# EAGLE design CAN_Funktionsdecoder (EAGLE 9.6.2)
Selectrix Arduino
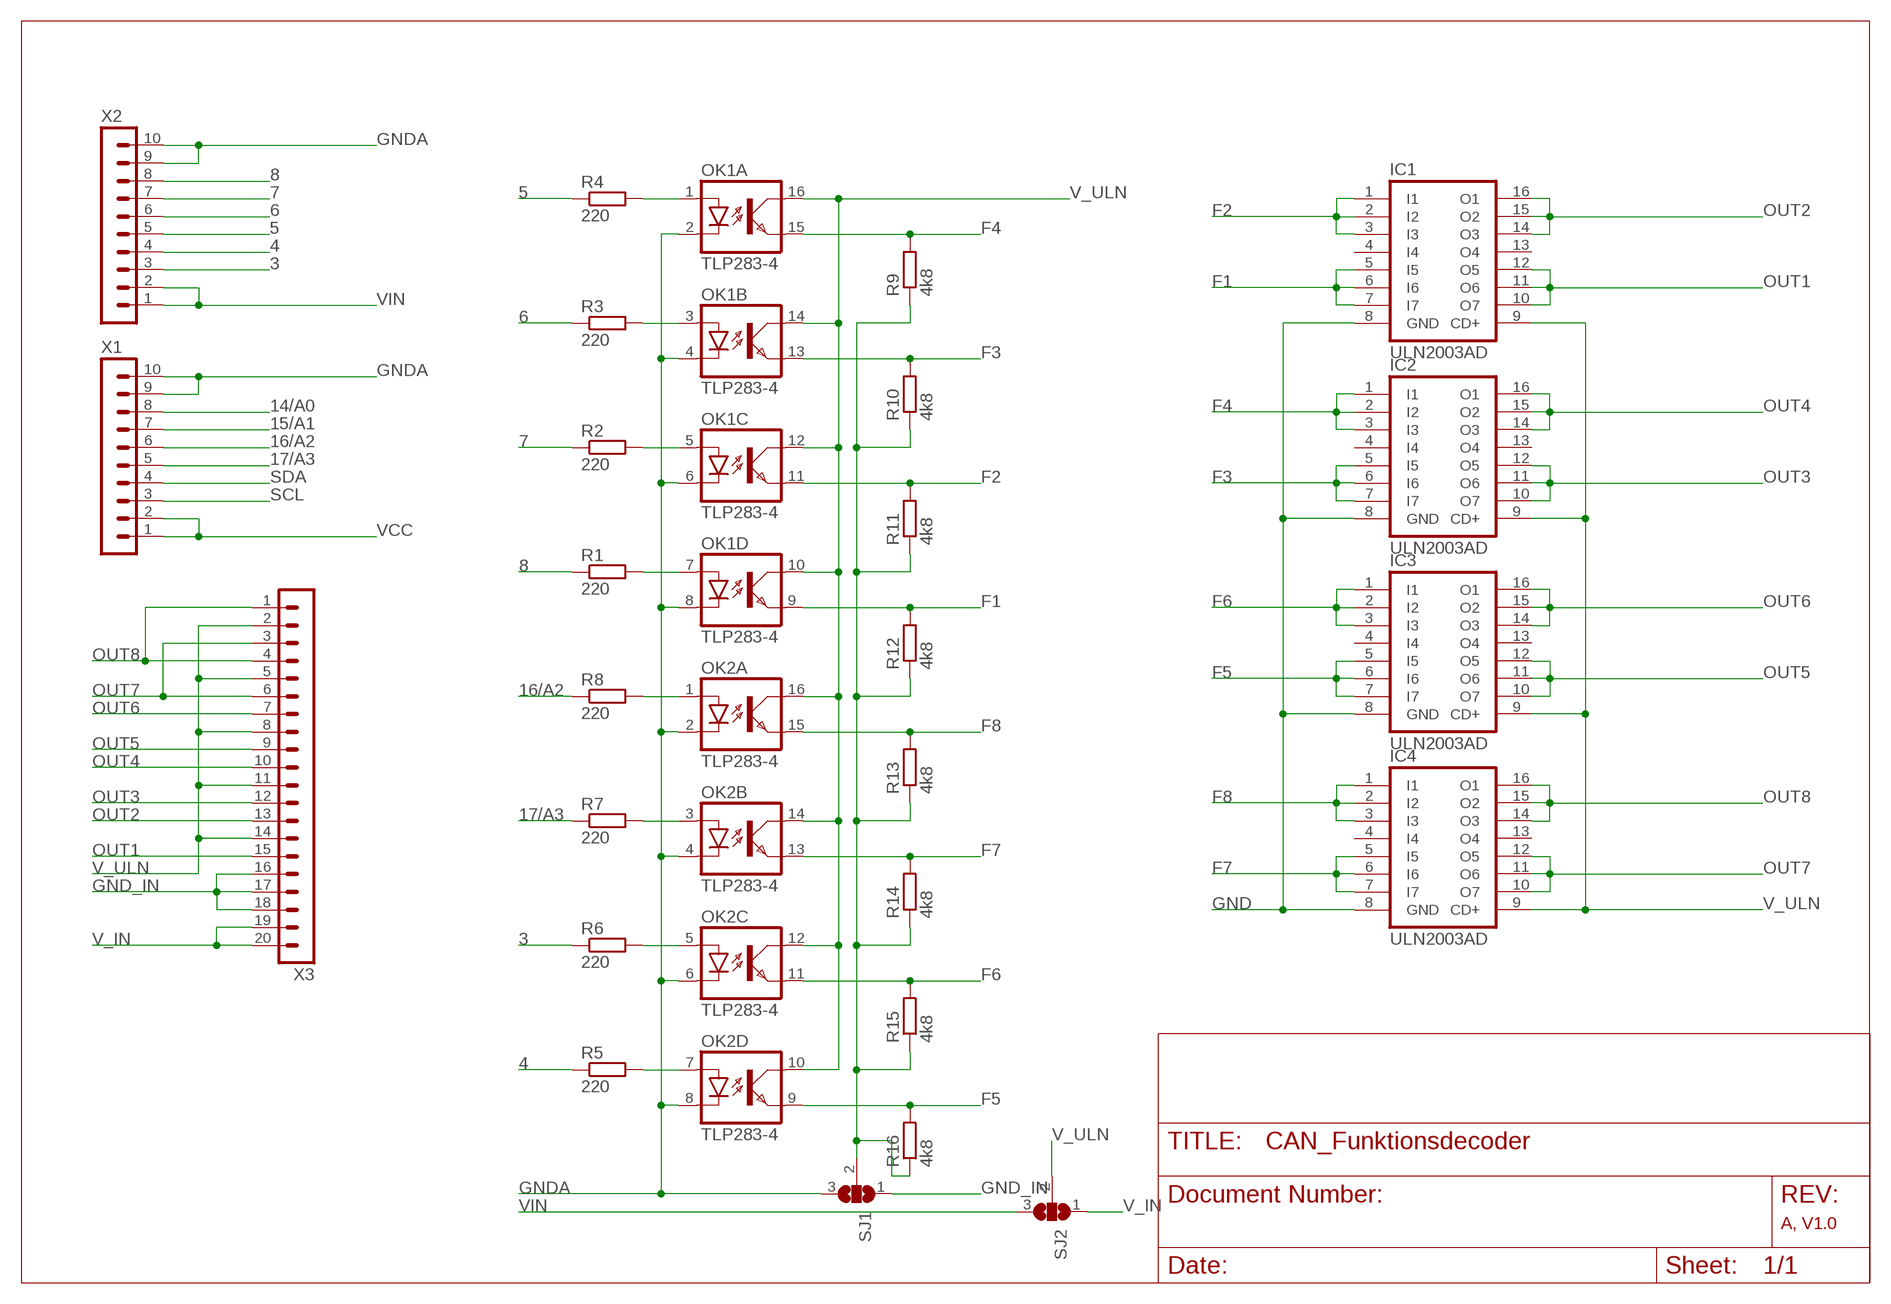
[diagram p0: schematic, sheet 1]

## Parts
IC1  ULN2003AD  [SO16]
IC2  ULN2003AD  [SO16]
IC3  ULN2003AD  [SO16]
IC4  ULN2003AD  [SO16]
OK1  TLP283-4  [MINI-FLAT-16]
OK2  TLP283-4  [MINI-FLAT-16]
R1  220  R-EU_R0805  [R0805]
R2  220  R-EU_R0805  [R0805]
R3  220  R-EU_R0805  [R0805]
R4  220  R-EU_R0805  [R0805]
R5  220  R-EU_R0805  [R0805]
R6  220  R-EU_R0805  [R0805]
R7  220  R-EU_R0805  [R0805]
R8  220  R-EU_R0805  [R0805]
R9  4k8  R-EU_R0805  [R0805]
R10  4k8  R-EU_R0805  [R0805]
R11  4k8  R-EU_R0805  [R0805]
R12  4k8  R-EU_R0805  [R0805]
R13  4k8  R-EU_R0805  [R0805]
R14  4k8  R-EU_R0805  [R0805]
R15  4k8  R-EU_R0805  [R0805]
R16  4k8  R-EU_R0805  [R0805]
SJ1  SJ2W  [SJ_2]
SJ2  SJ2W  [SJ_2]
X1  MA10-1  [MA10-1]
X2  MA10-1  [MA10-1]
X3  MA20-1  [MA20-1]

## Nets
3: R6.1 X2.3
4: R5.1 X2.4
5: R4.1 X2.5
6: R3.1 X2.6
7: R2.1 X2.7
8: R1.1 X2.8
14/A0: X1.8
15/A1: X1.7
16/A2: R8.1 X1.6
17/A3: R7.1 X1.5
F1: IC1.5(I5) IC1.6(I6) IC1.7(I7) OK1.9(D:EMIT) R12.2
F2: IC1.1(I1) IC1.2(I2) IC1.3(I3) OK1.11(C:EMIT) R11.2
F3: IC2.5(I5) IC2.6(I6) IC2.7(I7) OK1.13(B:EMIT) R10.2
F4: IC2.1(I1) IC2.2(I2) IC2.3(I3) OK1.15(A:EMIT) R9.2
F5: IC3.5(I5) IC3.6(I6) IC3.7(I7) OK2.9(D:EMIT) R16.2
F6: IC3.1(I1) IC3.2(I2) IC3.3(I3) OK2.11(C:EMIT) R15.2
F7: IC4.5(I5) IC4.6(I6) IC4.7(I7) OK2.13(B:EMIT) R14.2
F8: IC4.1(I1) IC4.2(I2) IC4.3(I3) OK2.15(A:EMIT) R13.2
GND: IC1.8(GND) IC2.8(GND) IC3.8(GND) IC4.8(GND) R9.1 R10.1 R11.1 R12.1 R13.1 R14.1 R15.1 R16.1 SJ1.2
GND_IN: SJ1.1 X3.16 X3.17 X3.18
GNDA: OK1.2(A:C) OK1.4(B:C) OK1.6(C:C) OK1.8(D:C) OK2.2(A:C) OK2.4(B:C) OK2.6(C:C) OK2.8(D:C) SJ1.3 X1.9 X1.10 X2.9 X2.10
N$2: OK1.3(B:A) R3.2
N$3: OK1.1(A:A) R4.2
N$4: OK1.5(C:A) R2.2
N$5: OK1.7(D:A) R1.2
N$6: OK2.1(A:A) R8.2
N$7: OK2.3(B:A) R7.2
N$8: OK2.5(C:A) R6.2
N$9: OK2.7(D:A) R5.2
OUT1: IC1.10(O7) IC1.11(O6) IC1.12(O5) X3.15
OUT2: IC1.14(O3) IC1.15(O2) IC1.16(O1) X3.13
OUT3: IC2.10(O7) IC2.11(O6) IC2.12(O5) X3.12
OUT4: IC2.14(O3) IC2.15(O2) IC2.16(O1) X3.10
OUT5: IC3.10(O7) IC3.11(O6) IC3.12(O5) X3.9
OUT6: IC3.14(O3) IC3.15(O2) IC3.16(O1) X3.7
OUT7: IC4.10(O7) IC4.11(O6) IC4.12(O5) X3.3 X3.6
OUT8: IC4.14(O3) IC4.15(O2) IC4.16(O1) X3.1 X3.4
SCL: X1.3
SDA: X1.4
V_IN: SJ2.1 X3.19 X3.20
V_ULN: IC1.9(CD+) IC2.9(CD+) IC3.9(CD+) IC4.9(CD+) OK1.10(D:COL) OK1.12(C:COL) OK1.14(B:COL) OK1.16(A:COL) OK2.10(D:COL) OK2.12(C:COL) OK2.14(B:COL) OK2.16(A:COL) SJ2.2 X3.2 X3.5 X3.8 X3.11 X3.14
VCC: X1.1 X1.2
VIN: SJ2.3 X2.1 X2.2
Unconnected: IC1.4(I4) IC1.13(O4) IC2.4(I4) IC2.13(O4) IC3.4(I4) IC3.13(O4) IC4.4(I4) IC4.13(O4)

## Notes on the sheet
- A, V1.0

## Library data of the parts
IC1-IC4 = uln-udn:ULN2003A: DRIVER ARRAY
OK1 OK2 = optocoupler:TLP283-4: TOSHIBA PHOTOCOUPLER GaAs IRED & PHOTO-TRANSISTOR Source: http://www.semicon.toshiba.co.jp/td/en/Opto/Photocoupler/en_20050928_TLP283_datasheet.pdf; OC_FARNELL: unknown; OC_NEWARK: unknown
R1-R16 = rcl:R-EU_: RESISTOR, European symbol; SPICEPREFIX: R
SJ1 SJ2 = jumper:SJ2W: SMD solder JUMPER
X1 X2 = con-lstb:MA10-1: PIN HEADER; OC_FARNELL: unknown; OC_NEWARK: unknown
X3 = con-lstb:MA20-1: PIN HEADER; OC_FARNELL: unknown; OC_NEWARK: unknown

## Board
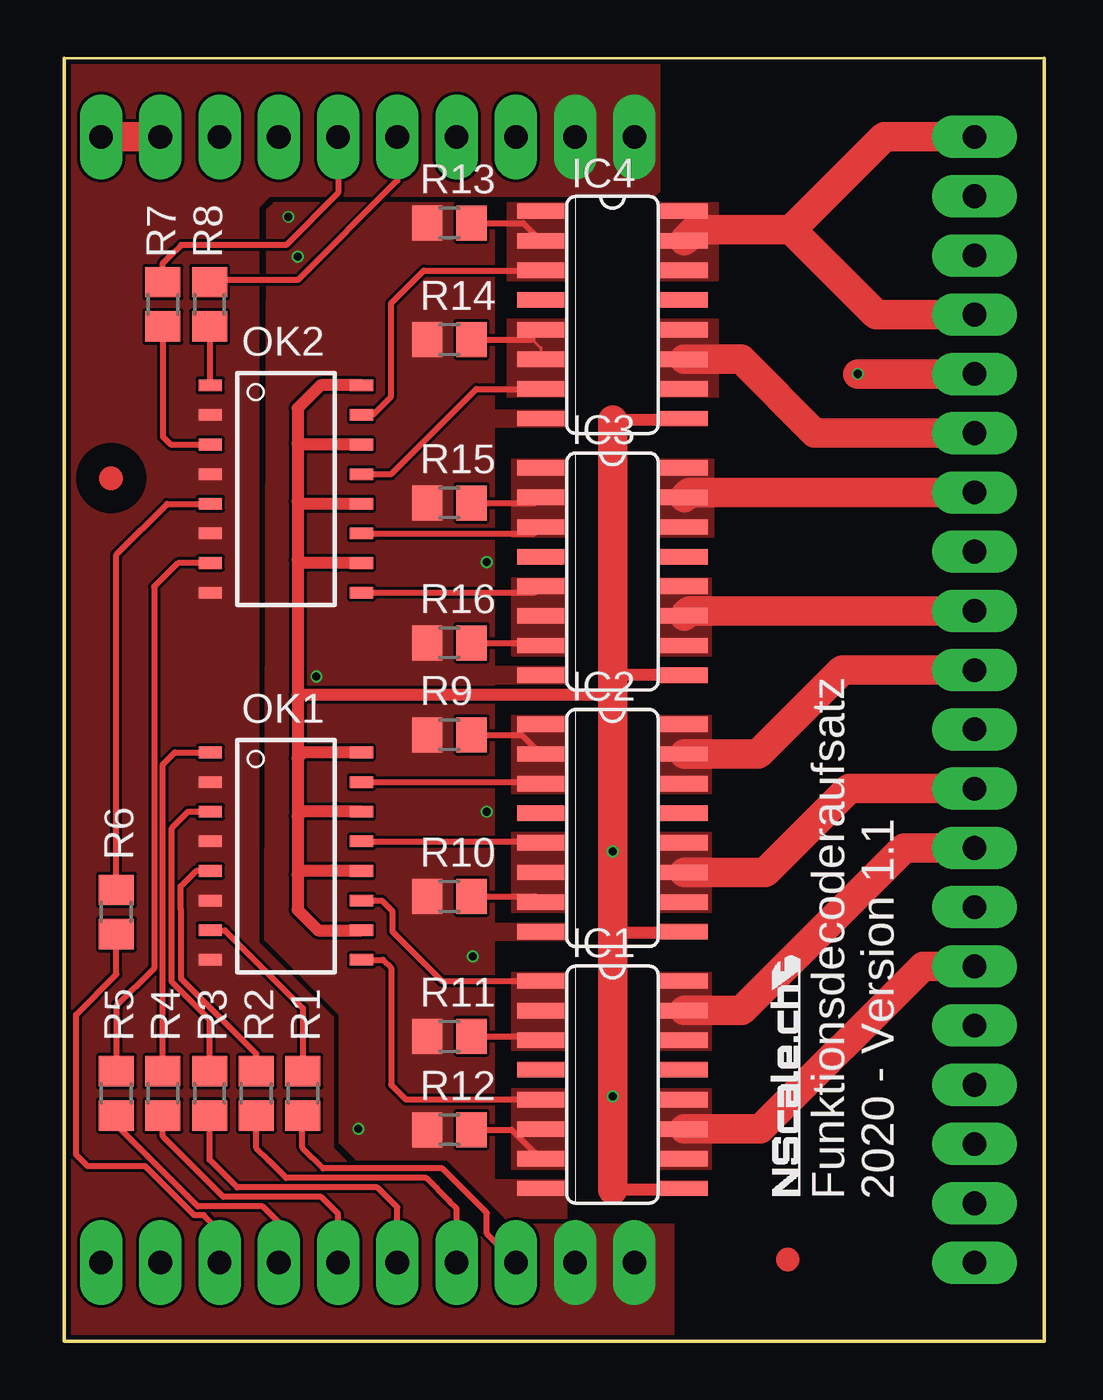
[diagram p1: board, top side]
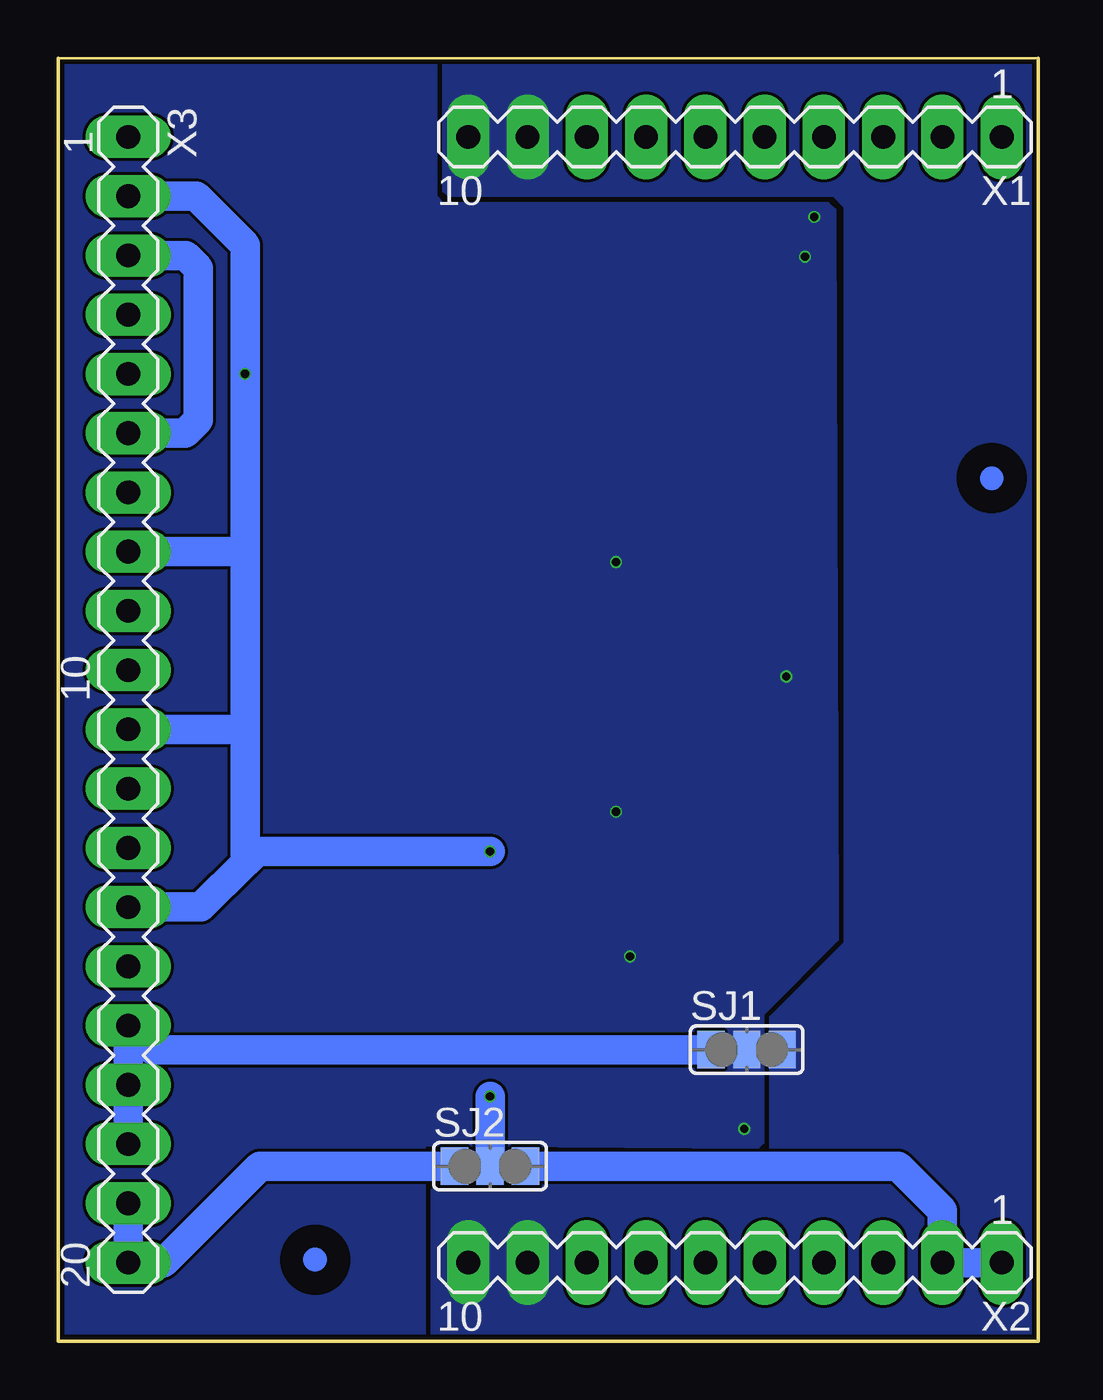
[diagram p2: board, bottom side, seen from below]

Size 42 x 55 mm. Coordinates in mm from the lower left corner, seen from the top.
Outline: 0,0 42,0 42,55 0,55 0,0
Copper layers (1*16): Top 0.035mm / dielectric 1.6mm / Bottom 0.035mm
Design rules "jlcpcb-2layers": minimum track width 5mil, minimum drill 0.3mm, track to track 5mil, track to pad 5mil, pad to pad 5mil, via to via 5mil, smd to smd 5mil, copper to edge 0.2mm, drill to drill 6mil, minimum pad ring 10mil, minimum via ring 3mil, stop-mask expansion 4mil, vias tented up to drill 0mil, thermal gap 10mil

### Footprints (pad centres in the part's own frame; a part is rotated, then mirrored left to right if it is on the bottom)
SO16 = smd 0.66 x 2.032: 1 -4.445,-3.073; 2 -3.175,-3.073; 3 -1.905,-3.073; 4 -0.635,-3.073; 5 0.635,-3.073; 6 1.905,-3.073; 7 3.175,-3.073; 8 4.445,-3.073; 9 4.445,3.073; 10 3.175,3.073; 11 1.905,3.073; 12 0.635,3.073; 13 -0.635,3.073; 14 -1.905,3.073; 15 -3.175,3.073; 16 -4.445,3.073
MINI-FLAT-16 = smd 1 x 0.5: 1 -3.24,4.445; 2 -3.24,3.175; 3 -3.24,1.905; 4 -3.24,0.635; 5 -3.24,-0.635; 6 -3.24,-1.905; 7 -3.24,-3.175; 8 -3.24,-4.445; 9 3.24,-4.445; 10 3.24,-3.175; 11 3.24,-1.905; 12 3.24,-0.635; 13 3.24,0.635; 14 3.24,1.905; 15 3.24,3.175; 16 3.24,4.445
R0805 = smd 1.3 x 1.5: 1 -0.95,0; 2 0.95,0
SJ_2 = smd 1.168 x 1.6: 1 -1.524,0; 2 0,0; 3 1.524,0
MA10-1 = drill 1.016 long: 1 -11.43,0; 2 -8.89,0; 3 -6.35,0; 4 -3.81,0; 5 -1.27,0; 6 1.27,0; 7 3.81,0; 8 6.35,0; 9 8.89,0; 10 11.43,0
MA20-1 = drill 1.016 long: 1 -24.13,0; 2 -21.59,0; 3 -19.05,0; 4 -16.51,0; 5 -13.97,0; 6 -11.43,0; 7 -8.89,0; 8 -6.35,0; 9 -3.81,0; 10 -1.27,0; 11 1.27,0; 12 3.81,0; 13 6.35,0; 14 8.89,0; 15 11.43,0; 16 13.97,0; 17 16.51,0; 18 19.05,0; 19 21.59,0; 20 24.13,0

### Placement (x,y rotation side)
IC1  23.49,11 270 top
IC2  23.49,22 270 top
IC3  23.49,33 270 top
IC4  23.49,44 270 top
OK1  9.5,20.8 0 top
OK2  9.5,36.53 0 top
R1  10.23,10.62 90 top
R2  8.23,10.62 90 top
R3  6.23,10.62 90 top
R4  4.23,10.62 90 top
R5  2.23,10.62 90 top
R6  2.23,18.4 90 top
R7  4.23,44.45 270 top
R8  6.23,44.45 270 top
R9  16.5,26 0 top
R10  16.5,19.07 0 top
R11  16.5,13.07 0 top
R12  16.5,9.07 0 top
R13  16.5,47.94 0 top
R14  16.5,42.94 0 top
R15  16.5,35.94 0 top
R16  16.5,29.94 0 top
SJ1  12.5,12.5 0 bottom
SJ2  23.5,7.5 0 bottom
U$1  [CIRCLE-1MM-3R]  2,37 176.6 top
U$2  [CIRCLE-1MM-3R]  31,3.5 176.6 top
X1  13,51.63 180 bottom
X2  13,3.37 180 bottom
X3  39,27.5 270 bottom

### Tracks (layer width: path | path; a pad name or v marks a point on that pad's centre or on a via)
3
  Top 0.254: X2.3 6.65,4.72 5.98,5.4 5.56,5.4 3.46,7.5 1,7.5 0.5,8 0.5,14 2.23,15.73 R6.1
4
  Top 0.254: X2.4 9.19,5.09 8.5,5.78 5.72,5.78 2.23,9.28 R5.1
5
  Top 0.254: X2.5 11.73,5.46 11,6.19 6.81,6.19 4.23,8.78 R4.1
6
  Top 0.254: X2.6 14.27,5.73 13.41,6.59 7.41,6.59 6.23,7.78 R3.1
7
  Top 0.254: X2.7 16.81,5.69 16.5,6 15.5,7 9.5,7 8.75,7.75 8.23,8.28 R2.1
8
  Top 0.254: R1.1 10.2,9.55 10.2,8.29 11.09,7.41 16.2,7.41 18.11,5.5 18.11,4.61 X2.8
16/A2
  Top 0.254: R8.1 6.2,45.5 10,45.5 14.27,49.77 X1.6
17/A3
  Top 0.254: X1.5 11.73,49.23 9.5,47 5,47 4.5,46.5 4.23,46.23 R7.1
F1
  Top 0.254: R12.2 19.17,9.07 IC1.7 | IC1.5 14.63,10.37 14,11 14,16 13.65,16.35 OK1.9
  pour Top (no thermals): 21.5,10.8 19.2,10.8 19.2,7.4 21.5,7.4
F2
  Top 0.254: R11.2 20.25,13.07 IC1.3 | IC1.1 16.18,15.45 14.06,17.56 14.06,18.44 13.61,18.89 OK1.11
  pour Top (no thermals): 21.5,15.8 19.2,15.8 19.2,12.5 21.5,12.5
F3
  Top 0.254: OK1.13 20.35,21.43 IC2.5 | R10.2 20.17,19.07 IC2.7
  pour Top (no thermals): 21.5,21.8 19.2,21.8 19.2,18.4 21.5,18.4
F4
  Top 0.254: OK1.15 20.35,23.97 IC2.3 | R9.2 19.59,26 IC2.2
  pour Top (no thermals): 21.5,26.8 19.2,26.8 19.2,23.5 21.5,23.5
F5
  Top 0.254: OK2.9 20.14,32.09 IC3.5 | R16.2 20.3,29.94 IC3.7
  pour Top (no thermals): 21.5,32.7 19.2,32.7 19.2,29.4 21.5,29.4
F6
  Top 0.254: R15.2 20.18,35.94 20.4,36.16 | OK2.11 20.14,34.63 IC3.3
  Top 0.508: 20.4,36.16 IC3.2
  pour Top (no thermals): 21.5,37.8 19.2,37.8 19.2,34.5 21.5,34.5
F7
  Top 0.127: 20.06,42.94 20.42,42.58 IC4.6
  Top 0.254: R14.2 20.06,42.94 | OK2.13 14,37.17 17.66,40.83 IC4.7
  pour Top (no thermals): 21.5,43.8 19,43.8 19,40.5 21.5,40.5
F8
  Top 0.254: IC4.3 15.41,45.91 14,44.5 14,40.5 13.21,39.71 OK2.15 | R13.2 19.65,47.94 IC4.2
  pour Top (no thermals): 21.5,48.8 19,48.8 19,45.5 21.5,45.5
GND  (via drill 0.35)
  other vias: 9.6,48.2 12.6,9.1 18.1,22.7 18.1,33.4 10.8,28.5 17.5,16.5 10,46.5
  pour Bottom (no thermals): 11.8,14 11.8,8.5 12,8.3 26.3,8.4 26.3,0 42,0 42,54.9 42.1,55 25.8,55 25.8,49.1 25.5,48.8 9,48.8 8.7,48.5 8.6,17.8 8.6,17.2
  pour Top (no thermals): 9,48.8 18.4,48.8 18.4,39.9 21.4,39.9 21.4,39.2 18.4,39.2 18.4,28.9 21.5,28.9 21.5,28.2 18.4,28.2 18.4,17.9 21.5,17.9 21.5,17.2 18.4,17.2 18.4,6.9 21.5,6.9 21.5,5.3 18.9,5.3 16.4,7.8 12.5,7.8 12.5,7.8 11.8,8.51 11.8,14 8.6,17.2 8.7,48.5
GND_IN
  Bottom 0.61: SJ1.1 14.5,12.5
  Bottom 1.27: 14.5,12.5 27,12.5 29.9,12.5 37.97,12.5 X3.16 X3.17 X3.18
GNDA
  pour Bottom (rank 2, no thermals): 0,55 25.5,55 25.5,49.3 25.3,49.1 8.8,49.1 8.3,48.6 8.3,17.1 11.5,13.9 11.5,8.3 12.3,7.5 21.9,7.5 21.9,6.5 26,6.5 26,0 0,0
  pour Top (rank 2, no thermals): 0,55 25.5,55 25.5,49.3 25.3,49.1 8.8,49.1 8.3,48.6 8.3,17.1 11.5,13.9 11.5,8.3 12.4,7.4 16.8,7.4 16.8,5 26.1,5 26.1,0 0,0
N$2
  Top 0.254: R3.2 6.23,13.77 4.61,15.39 4.61,22 5.31,22.7 OK1.3
N$3
  Top 0.254: R4.2 4.23,24.73 4.74,25.24 OK1.1
N$4
  Top 0.254: R2.2 8.23,12.31 5,15.54 5,18.5 4.99,18.51 4.99,19.5 5.65,20.16 OK1.5
N$5
  Top 0.254: OK1.7 6.88,17.62 10.23,14.27 R1.2
N$6
  Top 0.254: R8.2 6.25,43.41 OK2.1
N$7
  Top 0.254: R7.2 4.23,38.77 4.56,38.44 OK2.3
N$8
  Top 0.254: R6.2 2.23,33.73 4.4,35.9 OK2.5
N$9
  Top 0.254: R5.2 2.23,14.37 3.84,15.99 3.84,32.34 4.86,33.36 OK2.7
OUT1
  Top 1.27: IC1.11 29.83,9.1 36.8,16.07 X3.15
  pour Top (no thermals): 27.7,10.8 25.5,10.8 25.5,7.4 27.7,7.4
OUT2
  Top 1.27: IC1.15 29.02,14.18 36,21.15 X3.13
  pour Top (no thermals): 27.7,15.8 25.5,15.8 25.5,12.5 27.7,12.5
OUT3
  Top 1.27: IC2.11 30.05,20.09 33.64,23.69 X3.12
  pour Top (no thermals): 27.7,21.8 25.5,21.8 25.5,18.4 27.7,18.4
OUT4
  Top 1.27: IC2.15 29.73,25.18 33.33,28.77 X3.10 39.23,28.77
  pour Top (no thermals): 27.7,26.8 25.5,26.8 25.5,23.5 27.7,23.5
OUT5
  Top 1.27: X3.9 26.78,31.31 IC3.11
  pour Top (no thermals): 27.7,32.7 25.5,32.7 25.5,29.4 27.7,29.4
OUT6
  Top 1.27: X3.7 26.78,36.39 IC3.15
  pour Top (no thermals): 27.8,37.8 25.5,37.8 25.5,34.5 27.8,34.5
OUT7
  Top 1.27: IC4.11 29,42.09 32.16,38.93 X3.6
  Bottom 1.27: X3.6 36.57,38.93 36,39.5 36,46 36.55,46.55 X3.3
  pour Top (no thermals): 28,43.8 25.5,43.8 25.5,40.5 28,40.5
OUT8
  Top 1.27: X3.1 35.13,51.63 31.16,47.66 | IC4.15 27.04,47.66 31.16,47.66 | 31.16,47.66 33.66,45.16 34.32,44.49 34.8,44.01 X3.4
  pour Top (no thermals): 28,48.8 25.5,48.8 25.5,45.5 28,45.5
V_IN
  Bottom 1.27: X3.19 X3.20 37.49,3.37 35.68,5.18 34.84,6.03 33.37,7.5 SJ2.1
V_ULN  (via drill 0.35)
  Top 0.508: IC4.9 26.51,39.5 23.5,39.5 | IC1.9 26.51,6.5 23.5,6.5 | IC2.9 26.51,17.5 23.5,17.5 | IC3.9 23.55,28.55 23.5,28.5 | OK1.10 10.88,17.62 10,18.5 10,20 | OK2.16 10.98,40.98 10,40 10,38.5 | 10,38.5 10,36 | 10,36 10,33.5 | 10,33.5 10,27.7 | 10,27.7 10,25 | 10,25 10,22.5 | 10,22.5 10,20 | OK2.14 10.06,38.44 10,38.5 | OK2.12 10.1,35.9 10,36 | OK2.10 10.14,33.36 10,33.5 | OK1.12 10.16,20.16 10,20 | OK1.14 10.2,22.7 10,22.5 | OK1.16 10.24,25.24 10,25 | 23.5,27.7 10,27.7
  Top 1.27: 23.5,6.5 v23.5,10.5 23.5,17.5 v23.5,21 23.5,27.7 23.5,28.5 23.5,39.5 | X3.5 34.03,41.47 v34,41.47
  Bottom 1.27: SJ2.2 v23.5,10.5 | X3.14 35.89,18.61 34,20.5 | X3.2 36.09,49.09 34,47 v34,41.47 34,33.5 | 34,33.5 34,26.5 | 34,26.5 34,20.5 | X3.11 34.27,26.23 34,26.5 | X3.8 34.35,33.85 34,33.5 | v23.5,21 33.5,21 34,20.5
VCC
  Top 1.27: X1.2 X1.1
VIN
  Bottom 1.27: X2.1 X2.2 4.11,5.61 6,7.5 SJ2.3

### Text on the board
tPlace: C:/Users/Patrik Laube/Pictures/logo_sw.bmp
tNames: Funktionsdecoderaufsatz / 2020 - Version 1.1